# EAGLE design minime_2.1.1 (EAGLE 7.5.0)
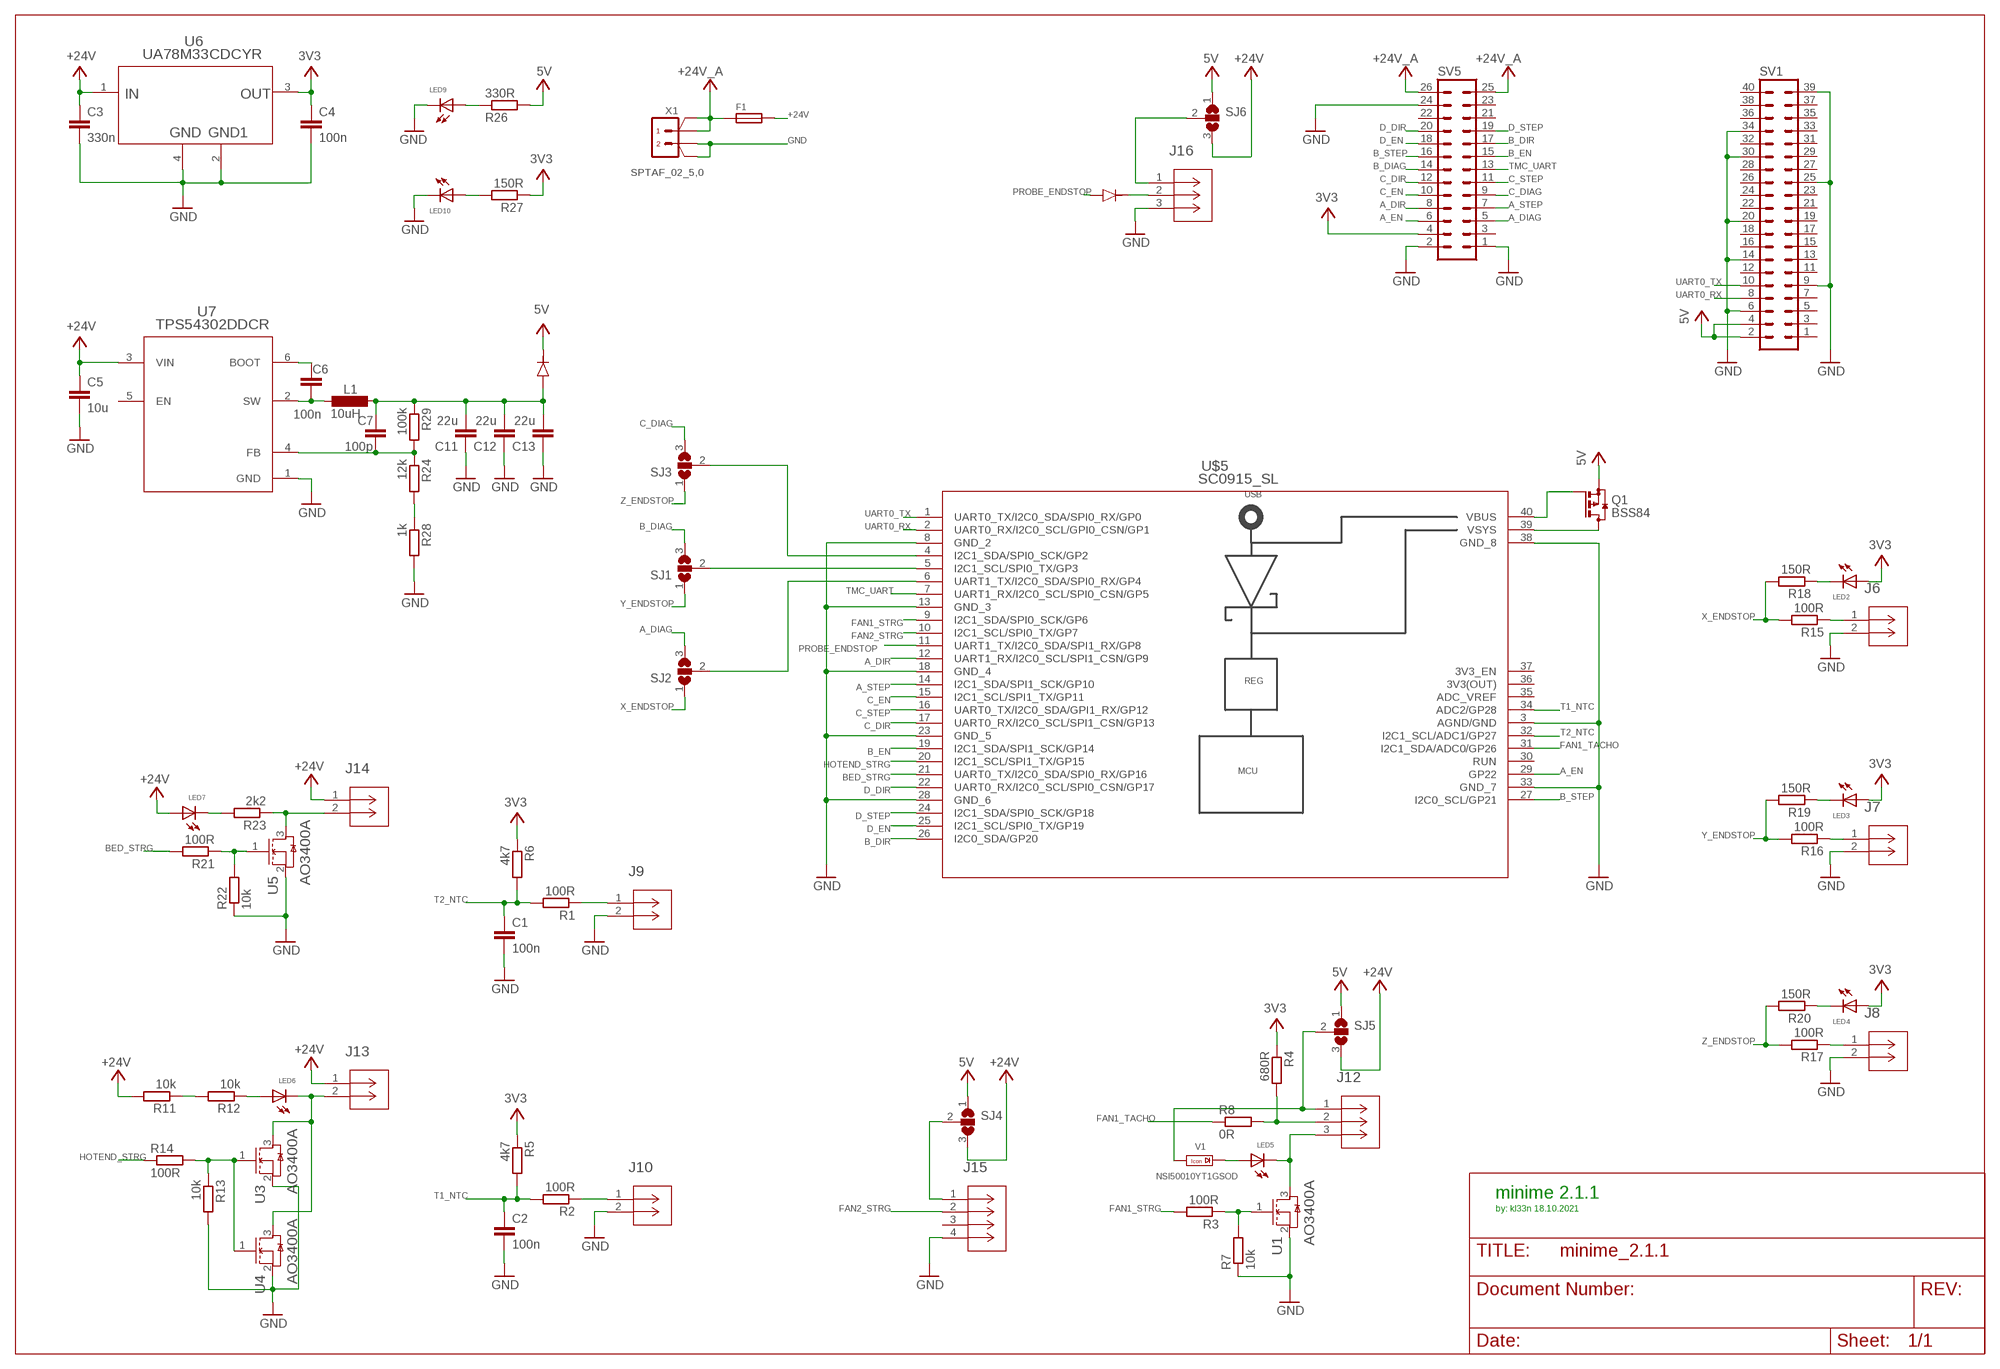
[diagram p0: schematic, sheet 1]

## Parts
C1  100n  C-EUC0603  [C0603]
C2  100n  C-EUC0603  [C0603]
C3  330n  C-EUC0603  [C0603]
C4  100n  C-EUC0603  [C0603]
C5  10u  C-EUC0603  [C0603]
C6  100n  C-EUC0603  [C0603]
C7  100p  C-EUC0603  [C0603]
C11  22u  C-EUC1210K  [C1210K]
C12  22u  C-EUC1210K  [C1210K]
C13  22u  C-EUC1210K  [C1210K]
CR1  SS54  SS14-E3/5AT  [DIODE_DO214AC]
CR2  SS14  SS14-E3/5AT  [DIODE_DO214AC]
F1  FUSE/SERIE154  [FUSE/NANO-OMNI]
J6  B2B-XH-A(LF)(SN)  [CONN_B2B-XH-A(LF)(SN)_JST]
J7  B2B-XH-A(LF)(SN)  [CONN_B2B-XH-A(LF)(SN)_JST]
J8  B2B-XH-A(LF)(SN)  [CONN_B2B-XH-A(LF)(SN)_JST]
J9  B2B-XH-A(LF)(SN)  [CONN_B2B-XH-A(LF)(SN)_JST]
J10  B2B-XH-A(LF)(SN)  [CONN_B2B-XH-A(LF)(SN)_JST]
J12  B3B-XH-A(LF)(SN)  [CONN_B3B-XH-A_JST]
J13  B2B-XH-A(LF)(SN)  [CONN_B2B-XH-A(LF)(SN)_JST]
J14  B2B-XH-A(LF)(SN)  [CONN_B2B-XH-A(LF)(SN)_JST]
J15  B4B-XH-AM(LF)(SN)  [CONN_B4B-XH-AM_JST]
J16  B3B-XH-A(LF)(SN)  [CONN_B3B-XH-A_JST]
L1  10uH  L-EUWE-TPC  [POWER-CHOKE_WE-TPC]
LED2  LEDCHIP-LED0603  [CHIP-LED0603]
LED3  LEDCHIP-LED0603  [CHIP-LED0603]
LED4  LEDCHIP-LED0603  [CHIP-LED0603]
LED5  LEDCHIP-LED0603  [CHIP-LED0603]
LED6  LEDCHIP-LED0603  [CHIP-LED0603]
LED7  LEDCHIP-LED0603  [CHIP-LED0603]
LED9  LEDCHIP-LED0603  [CHIP-LED0603]
LED10  LEDCHIP-LED0603  [CHIP-LED0603]
Q1  BSS84  [SOT23]
R1  100R  R-EU_R0603  [R0603]
R2  100R  R-EU_R0603  [R0603]
R3  100R  R-EU_R0603  [R0603]
R4  680R  R-EU_R0603  [R0603]
R5  4k7  R-EU_R0603  [R0603]
R6  4k7  R-EU_R0603  [R0603]
R7  10k  R-EU_R0603  [R0603]
R8  0R  R-EU_R0603  [R0603]
R11  10k  R-EU_R0603  [R0603]
R12  10k  R-EU_R0603  [R0603]
R13  10k  R-EU_R0603  [R0603]
R14  100R  R-EU_R0603  [R0603]
R15  100R  R-EU_R0603  [R0603]
R16  100R  R-EU_R0603  [R0603]
R17  100R  R-EU_R0603  [R0603]
R18  150R  R-EU_R0603  [R0603]
R19  150R  R-EU_R0603  [R0603]
R20  150R  R-EU_R0603  [R0603]
R21  100R  R-EU_R0603  [R0603]
R22  10k  R-EU_R0603  [R0603]
R23  2k2  R-EU_R0603  [R0603]
R24  12k  R-EU_R0603  [R0603]
R26  330R  R-EU_R0603  [R0603]
R27  150R  R-EU_R0603  [R0603]
R28  1k  R-EU_R0603  [R0603]
R29  100k  R-EU_R0603  [R0603]
SJ1  SJ2W  [SJ_2]
SJ2  SJ2W  [SJ_2]
SJ3  SJ2W  [SJ_2]
SJ4  SJ2W  [SJ_2]
SJ5  SJ2W  [SJ_2]
SJ6  SJ2W  [SJ_2]
SV1  MA20-2  [MA20-2]
SV5  MA13-2  [MA13-2]
U1  AO3400A  [SOT-23-3L_AOS]
U3  AO3400A  [SOT-23-3L_AOS]
U4  AO3400A  [SOT-23-3L_AOS]
U5  AO3400A  [SOT-23-3L_AOS]
U6  UA78M33CDCYR  [DCY0004A_N]
U7  TPS54302DDCR  [DDC0006A_N]
U$5  SC0915_SL  [STIFTLEISTE]
V1  NSI50010YT1GSOD  [SOD123]
X1  SPTAF_02_5,0  [5-2]

## Nets
3V3: C4.1 LED2.A LED3.A LED4.A R4.1 R5.1 R6.1 R27.1 SV5.4 U6.3(OUTPUT)
5V: CR1.1 Q1.2(S) R26.2 SJ4.1 SJ5.1 SJ6.1 SV1.2 SV1.4
+24V: C3.1 C5.1 F1.2 J13.1 J14.1 LED7.A R11.2 SJ4.3 SJ5.3 SJ6.3 U6.1(INPUT) U7.3(VIN)
+24V_A: F1.1 SV5.25 SV5.26 X1.1 X1.1A
A_DIAG: SJ2.3 SV5.5
A_DIAG_X_ENDSTOP: SJ2.2 U$5.6(UART1_TX/I2C0_SDA/SPI0_RX/GP4)
A_DIR: SV5.8 U$5.12(UART1_RX/I2C0_SCL/SPI1_CSN/GP9)
A_EN: SV5.6 U$5.29(GP22)
A_STEP: SV5.7 U$5.14(I2C1_SDA/SPI1_SCK/GP10)
B_DIAG: SJ1.3 SV5.14
B_DIAG_Y_ENDSTOP: SJ1.2 U$5.5(I2C1_SCL/SPI0_TX/GP3)
B_DIR: SV5.17 U$5.26(I2C0_SDA/GP20)
B_EN: SV5.15 U$5.19(I2C1_SDA/SPI1_SCK/GP14)
B_STEP: SV5.16 U$5.27(I2C0_SCL/GP21)
BED_STRG: R21.2 U$5.21(UART0_TX/I2C0_SDA/SPI0_RX/GP16)
C_DIAG: SJ3.3 SV5.9
C_DIAG_Z_ENDSTOP: SJ3.2 U$5.4(I2C1_SDA/SPI0_SCK/GP2)
C_DIR: SV5.12 U$5.17(UART0_RX/I2C0_SCL/SPI1_CSN/GP13)
C_EN: SV5.10 U$5.15(I2C1_SCL/SPI1_TX/GP11)
C_STEP: SV5.11 U$5.16(UART0_TX/I2C0_SDA/GPI1_RX/GP12)
D_DIR: SV5.20 U$5.22(UART0_RX/I2C0_SCL/SPI0_CSN/GP17)
D_EN: SV5.18 U$5.25(I2C1_SCL/SPI0_TX/GP19)
D_STEP: SV5.19 U$5.24(I2C1_SDA/SPI0_SCK/GP18)
FAN1_STRG: R3.2 U$5.9(I2C1_SDA/SPI0_SCK/GP6)
FAN1_TACHO: R8.1 U$5.31(I2C1_SDA/ADC0/GP26)
FAN2_STRG: J15.2 U$5.10(I2C1_SCL/SPI0_TX/GP7)
GND: C1.2 C2.2 C3.2 C4.2 C5.2 C11.1 C12.1 C13.1 J6.2 J7.2 J8.2 J9.2 J10.2 J15.4 J16.3 LED9.C LED10.C R7.1 R13.2 R22.1 R28.2 SV1.6 SV1.9 SV1.14 SV1.20 SV1.25 SV1.30 SV1.34 SV1.39 SV5.1 SV5.2 SV5.24 U1.2(S) U3.2(S) U4.2(S) U5.2(S) U6.2(COMMON_2) U6.4(COMMON) U7.1(GND) U$5.3(AGND/GND) U$5.8(GND_2) U$5.13(GND_3) U$5.18(GND_4) U$5.23(GND_5) U$5.28(GND_6) U$5.33(GND_7) U$5.38(GND_8) X1.2 X1.2A
HOTEND_STRG: R14.1 U$5.20(I2C1_SCL/SPI1_TX/GP15)
N$1: LED6.A R12.1
N$2: R11.1 R12.2
N$3: R21.1 R22.2 U5.1(G)
N$4: R13.1 R14.2 U3.1(G) U4.1(G)
N$5: J16.1 SJ6.2
N$6: LED5.A V1.C(K)
N$11: J14.2 R23.1 U5.3(D)
N$22: J8.1 R17.1
N$23: J7.1 R16.1
N$24: J6.1 R15.1
N$25: J10.1 R2.1
N$26: LED2.C R18.1
N$27: LED3.C R19.1
N$28: J9.1 R1.1
N$29: J12.2 R4.2 R8.2
N$30: LED4.C R20.1
N$31: R3.1 R7.2 U1.1(G)
N$33: LED7.C R23.2
N$35: J12.3 LED5.C U1.3(D)
N$37: J13.2 LED6.C U3.3(D) U4.3(D)
N$40: LED9.A R26.1
N$41: J12.1 SJ5.2 V1.A
N$42: LED10.A R27.2
N$43: J15.1 SJ4.2
N$44: CR2.1 J16.2
N$45: R24.2 R28.1
N$47: C6.1 U7.6(BOOT)
N$48: C6.2 L1.2 U7.2(SW)
N$49: C7.2 R24.1 R29.2 U7.4(FB)
N$50: C7.1 C11.2 C12.2 C13.2 CR1.2 L1.1 R29.1
PROBE_ENDSTOP: CR2.2 U$5.11(UART1_TX/I2C0_SDA/SPI1_RX/GP8)
T1_NTC: C2.1 R2.2 R5.2 U$5.34(ADC2/GP28)
T2_NTC: C1.1 R1.2 R6.2 U$5.32(I2C1_SCL/ADC1/GP27)
TMC_UART: SV5.13 U$5.7(UART1_RX/I2C0_SCL/SPI0_CSN/GP5)
UART0_RX: SV1.8 U$5.2(UART0_RX/I2C0_SCL/GPI0_CSN/GP1)
UART0_TX: SV1.10 U$5.1(UART0_TX/I2C0_SDA/SPI0_RX/GP0)
VBUS: Q1.1(G) U$5.40(VBUS)
VSYS: Q1.3(D) U$5.39(VSYS)
X_ENDSTOP: R15.2 R18.2 SJ2.1
Y_ENDSTOP: R16.2 R19.2 SJ1.1
Z_ENDSTOP: R17.2 R20.2 SJ3.1
Unconnected: J15.3 SV1.1 SV1.3 SV1.5 SV1.7 SV1.11 SV1.12 SV1.13 SV1.15 SV1.16 SV1.17 SV1.18 SV1.19 SV1.21 SV1.22 SV1.23 SV1.24 SV1.26 SV1.27 SV1.28 SV1.29 SV1.31 SV1.32 SV1.33 SV1.35 SV1.36 SV1.37 SV1.38 SV1.40 SV5.3 SV5.21 SV5.22 SV5.23 U7.5(EN) U$5.30(RUN) U$5.36(3V3(OUT))

## Notes on the sheet
- USB
- REG
- MCU
- minime 2.1.1
- by: kl33n 18.10.2021

## Power pins joined to a net without a drawn wire
3V3_EN: U$5.37(3V3_EN)
ADC_VREF: U$5.35(ADC_VREF)

## Library data of the parts
C1-C7 C11-C13 = rcl:C-EU: CAPACITOR, European symbol
CR1 CR2 = SS14:SS14-E3/5AT; COPYRIGHT: Copyright (C) 2021 Ultra Librarian. All rights reserved.; MANUFACTURER_PART_NUMBER: SS14-E3/5AT; MFR_NAME: Vishay
F1 = RPG_parts:FUSE/SERIE154: FUSE, with Holder, Serie 154, SMD OMNI-BLOK
J6-J10 J13 J14 = B2B-XH-A:B2B-XH-A(LF)(SN); BUILT_BY: EMA_Cory; COPYRIGHT: Copyright (C) 2018 Accelerated Designs. All rights reserved; MANUFACTURER_PART_NUMBER: B2B-XH-A(LF)(SN); SOURCELIBRARY: JST_2019-12-02; VENDOR: JST
J12 J16 = B3B-XH-A:B3B-XH-A(LF)(SN); BUILT_BY: EMA_Cory; COPYRIGHT: Copyright (C) 2018 Accelerated Designs. All rights reserved; DATASHEET: https://www.jst-mfg.com/product/pdf/eng/eXH.pdf; MANUFACTURER_PART_NUMBER: B3B-XH-A(LF)(SN); SOURCELIBRARY: Add_to_database_2021-02-04; VENDOR: JST
J15 = B4B-XH-A:B4B-XH-AM(LF)(SN); BUILT_BY: EMA_Cory; COPYRIGHT: Copyright (C) 2018 Accelerated Designs. All rights reserved; DATASHEET: http://www.jst-mfg.com/product/pdf/eng/eXH.pdf; MANUFACTURER_PART_NUMBER: B4B-XH-AM(LF)(SN); SOURCELIBRARY: Add_to_database_2020-12-30; VENDOR: JST
L1 = rcl:L-EU: INDUCTOR, European symbol
LED2-LED7 LED9 LED10 = led:LED: LED OSRAM: - CHIPLED LG R971, LG N971, LY N971, LG Q971, LY Q971, LO R971, LY R971 LH N974, LH R974 LS Q976, LO Q976, LY Q976 LO Q996 - Hyper CHIPLED LW Q18S LB Q993, LB Q99A, LB R99A - SideLED LS A670, LO A670, LY A670, LG A670, LP A670 LB A673, LV A673, LT A673, LW A673 LH A674 LY A675 LS A676, LA A676, LO A676, LY A676, LW A676 LS A679, LY A679, LG A679 - Hyper Micro SIDELED® LS Y876, LA Y876, LO Y876, LY Y876 LT Y87S - SmartLED LW L88C, LW L88S LB L89C, LB L89S, LG L890 LS L89K, LO L89K, LY L89K LS L896, LA L896, LO L896, LY L896 - TOPLED LS T670, LO T670, LY T670, LG T670, LP T670 LSG T670, LSP T670, LSY T670, LOP T670, LYG T670 LG T671, LOG T671, LSG T671 LB T673, LV T673, LT T673, LW T673 LH T674 LS T676, LA T676, LO T676, LY T676, LB T676, LH T676, LSB T676, LW T676 LB T67C, LV T67C, LT T67C, LS T67K, LO T67K, LY T67K, LW E67C LS E67B, LA E67B, LO E67B, LY E67B, LB E67C, LV E67C, LT E67C LW T67C LS T679, LY T679, LG T679 LS T770, LO T770, LY T770, LG T770, LP T770 LB T773, LV T773, LT T773, LW T773 LH T774 LS E675, LA E675, LY E675, LS T675 LS T776, LA T776, LO T776, LY T776, LB T776 LHGB T686 LT T68C, LB T68C - Hyper Mini TOPLED® LB M676 - Mini TOPLED Santana® LG M470 LS M47K, LO M47K, LY M47K Source: http://www.osram.convergy.de LUXEON: - LUMILED® LXK2-PW12-R00, LXK2-PW12-S00, LXK2-PW14-U00, LXK2-PW14-V00 LXK2-PM12-R00, LXK2-PM12-S00, LXK2-PM14-U00 LXK2-PE12-Q00, LXK2-PE12-R00, LXK2-PE12-S00, LXK2-PE14-T00, LXK2-PE14-U00 LXK2-PB12-K00, LXK2-PB12-L00, LXK2-PB12-M00, LXK2-PB14-N00, LXK2-PB14-P00, LXK2-PB14-Q00 LXK2-PR12-L00, LXK2-PR12-M00, LXK2-PR14-Q00, LXK2-PR14-R00 LXK2-PD12-Q00, LXK2-PD12-R00, LXK2-PD12-S00 LXK2-PH12-R00, LXK2-PH12-S00 LXK2-PL12-P00, LXK2-PL12-Q00, LXK2-PL12-R00 Source: www.luxeon.com KINGBRIGHT: KA-3528ASYC Source: www.kingbright.com
Q1 = transistor-small-signal:BSS84: P-CHANNEL MOS FET
R1-R8 R11-R24 R26-R29 = rcl:R-EU_: RESISTOR, European symbol
SJ1-SJ6 = jumper:SJ2W: SMD solder JUMPER
SV1 = con-lstb:MA20-2: PIN HEADER; OC_FARNELL: unknown; OC_NEWARK: unknown
SV5 = con-lstb:MA13-2: PIN HEADER; OC_FARNELL: unknown; OC_NEWARK: unknown
U1 U3-U5 = AO3400A:AO3400A; BUILT_BY: EMA_Molly; COPYRIGHT: Copyright (C) 2018 Accelerated Designs. All rights reserved; MANUFACTURER_PART_NUMBER: AO3400A; SOURCELIBRARY: Alpha_and_Omega_2019-12-17; VENDOR: Alpha and Omega
U6 = UA78M33:UA78M33CDCYR; COPYRIGHT: Copyright (C) 2021 Ultra Librarian. All rights reserved.; MANUFACTURER_PART_NUMBER: UA78M33CDCYR; MFR_NAME: Texas Instruments; REFDES: RefDes; TYPE: TYPE
U7 = TPS54302:TPS54302DDCR; COPYRIGHT: Copyright (C) 2021 Ultra Librarian. All rights reserved.; MANUFACTURER_PART_NUMBER: TPS54302DDCR; MFR_NAME: Texas Instruments; REFDES: RefDes; TYPE: TYPE
U$5 = pi_pico:SC0915_SL
V1 = RPG_parts:NSI50010YT1G; FARNELL: 1794979
X1 = Phoenix_SPTAF-WTB:SPTAF_02_: SPTAF 1/ 2-3,5-EL - Wire-To-Board-Reihenklemme, 3.5 mm, 2 -polig, 24 AWG, 16 AWG, 1.5 mm², Steckanschluss

## Board
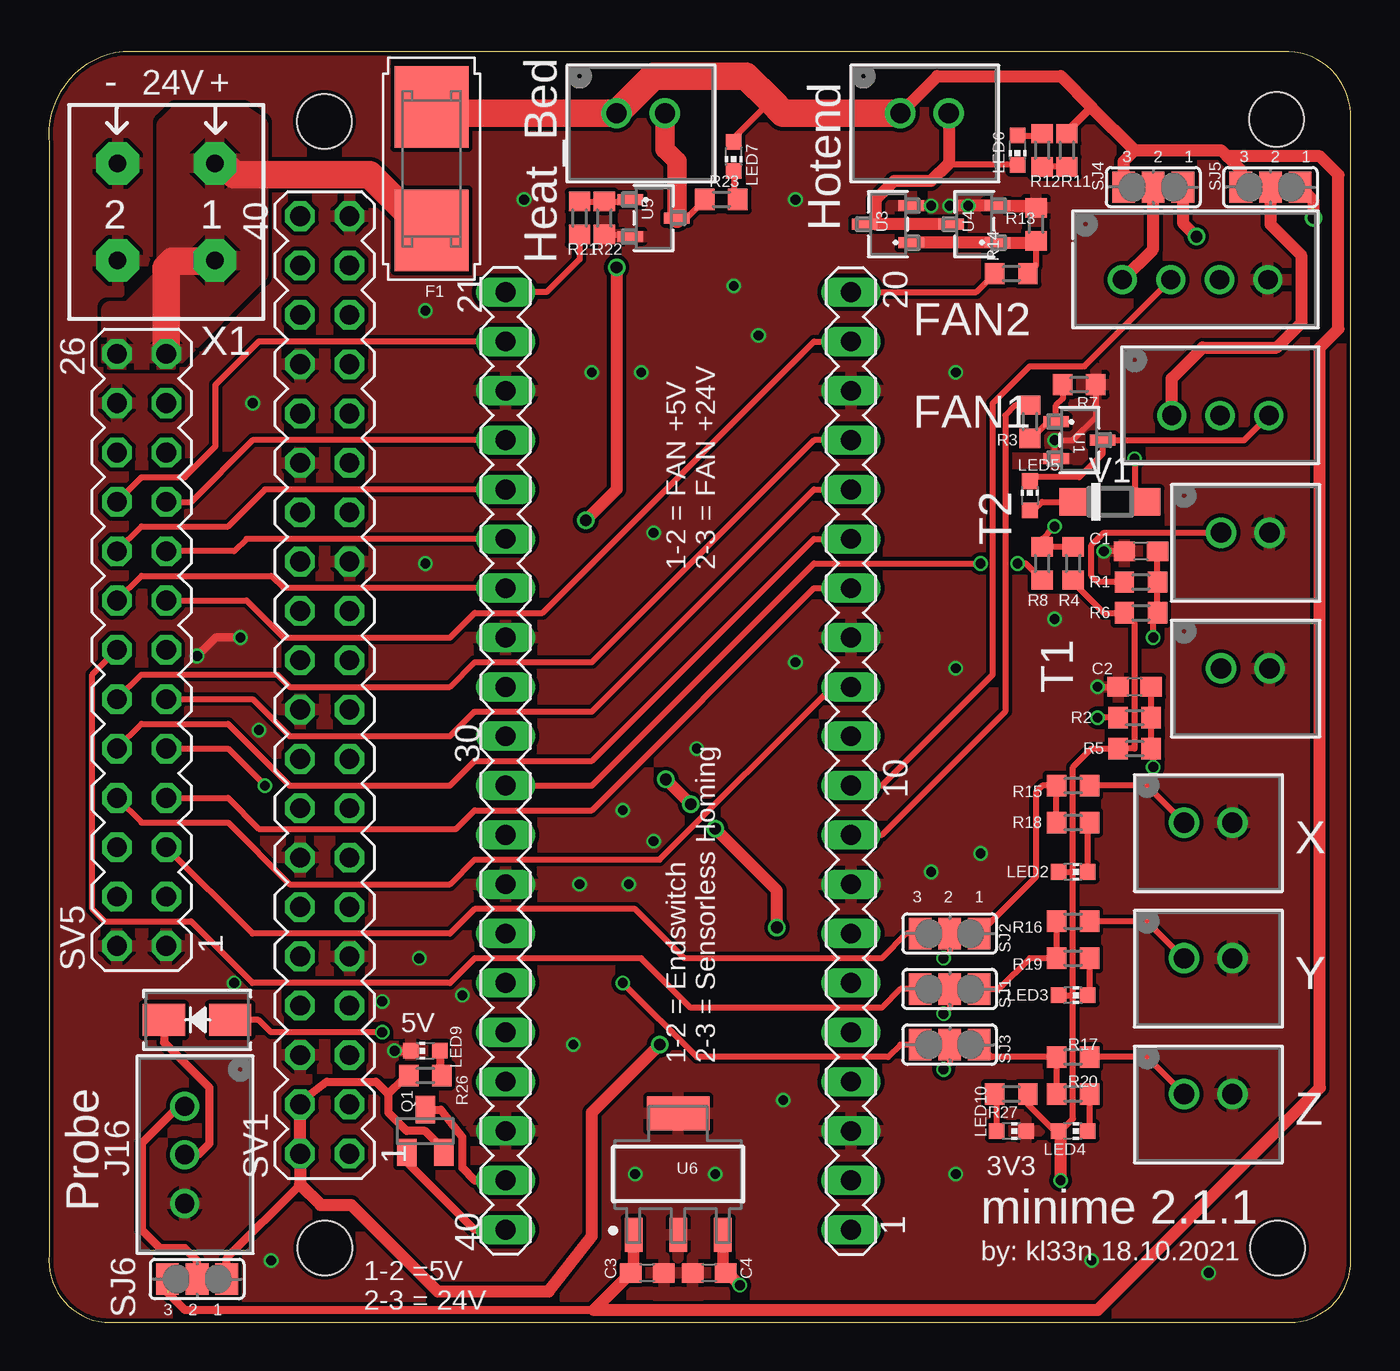
[diagram p1: board, top side]
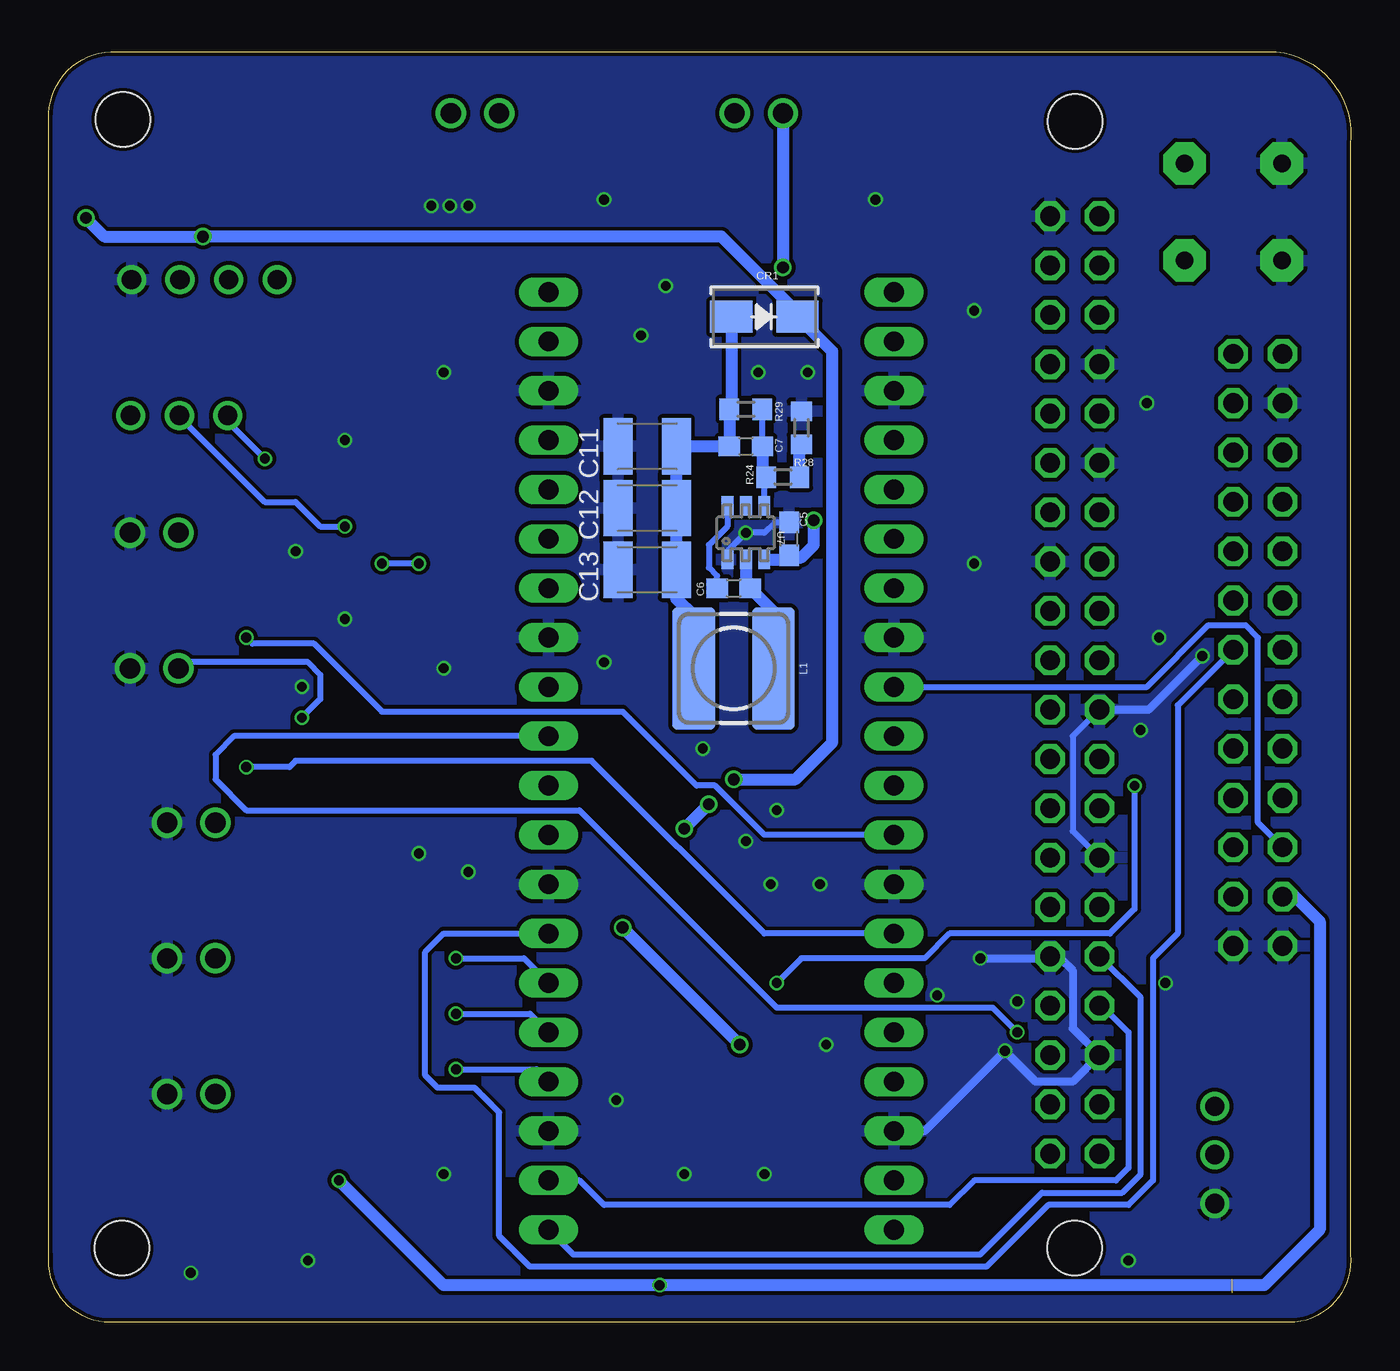
[diagram p2: board, bottom side, seen from below]

Size 67.03 x 65.41 mm. Coordinates in mm from the lower left corner, seen from the top.
Outline: 0.03,60.64 0.03,3.49 arc90 2.88,0 64.16,0 arc90 67.02,3.49 67.02,62.23 arc90 63.53,65.41 3.84,65.41 arc90 0.03,60.64
Copper layers (1*16): Top 0.018mm / dielectric 1.55mm / Bottom 0.018mm
Design rules "Multi-CB_2L_100µm-Tracks_OL35µm": minimum track width 0.1mm, minimum drill 0.2mm, track to track 0.1mm, track to pad 0.1mm, pad to pad 0.1mm, via to via 0.1mm, smd to smd 0mil, copper to edge 0.2mm, drill to drill 0.2mm, minimum pad ring 0.125mm, minimum via ring 0.1mm, stop-mask expansion 2mil, vias tented up to drill 0.45mm, thermal gap 0.2mm
Holes 2.8 mm at 14.22,3.81 14.19,61.8 63.26,3.81 63.21,61.91

### Footprints (pad centres in the part's own frame; a part is rotated, then mirrored left to right if it is on the bottom)
C0603 = smd 1.1 x 1: 1 -0.85,0; 2 0.85,0
C1210K = smd 1.5 x 2.9: 1 -1.5,0; 2 1.5,0
DIODE_DO214AC = smd 2.174 x 1.651: 1 -1.705,0; 2 1.705,0
FUSE/NANO-OMNI = smd 4.2 x 3.8: 1 -3.17,0; 2 3.17,0
CONN_B2B-XH-A(LF)(SN)_JST = drill 1.041 pad 1.549: 1 0,0; 2 -2.489,0
CONN_B3B-XH-A_JST = drill 0.991 pad 1.499: 1 0,0; 2 2.489,0; 3 5.004,0
CONN_B4B-XH-AM_JST = drill 0.991 pad 1.499: 1 0,0; 2 2.489,0; 3 5.004,0; 4 7.493,0
POWER-CHOKE_WE-TPC = smd 6.3 x 2.2: 1 0,2.05; 2 0,-2.05
CHIP-LED0603 = smd 0.8 x 0.8: A 0,-0.75; C 0,0.75
SOT23 = smd 1 x 1.4: 1 -0.95,-1.1; 2 0.95,-1.1; 3 0,1.1
R0603 = smd 1 x 1.1: 1 -0.85,0; 2 0.85,0
SJ_2 = smd 1.168 x 1.6: 1 -1.524,0; 2 0,0; 3 1.524,0
MA20-2 = drill 1.016 octagon: 1 -24.13,-1.27; 2 -24.13,1.27; 3 -21.59,-1.27; 4 -21.59,1.27; 5 -19.05,-1.27; 6 -19.05,1.27; 7 -16.51,-1.27; 8 -16.51,1.27; 9 -13.97,-1.27; 10 -13.97,1.27; 11 -11.43,-1.27; 12 -11.43,1.27; 13 -8.89,-1.27; 14 -8.89,1.27; 15 -6.35,-1.27; 16 -6.35,1.27; 17 -3.81,-1.27; 18 -3.81,1.27; 19 -1.27,-1.27; 20 -1.27,1.27; 21 1.27,-1.27; 22 1.27,1.27; 23 3.81,-1.27; 24 3.81,1.27; 25 6.35,-1.27; 26 6.35,1.27; 27 8.89,-1.27; 28 8.89,1.27; 29 11.43,-1.27; 30 11.43,1.27; 31 13.97,-1.27; 32 13.97,1.27; 33 16.51,-1.27; 34 16.51,1.27; 35 19.05,-1.27; 36 19.05,1.27; 37 21.59,-1.27; 38 21.59,1.27; 39 24.13,-1.27; 40 24.13,1.27
MA13-2 = drill 1.016 octagon: 1 -15.24,-1.27; 2 -15.24,1.27; 3 -12.7,-1.27; 4 -12.7,1.27; 5 -10.16,-1.27; 6 -10.16,1.27; 7 -7.62,-1.27; 8 -7.62,1.27; 9 -5.08,-1.27; 10 -5.08,1.27; 11 -2.54,-1.27; 12 -2.54,1.27; 13 0,-1.27; 14 0,1.27; 15 2.54,-1.27; 16 2.54,1.27; 17 5.08,-1.27; 18 5.08,1.27; 19 7.62,-1.27; 20 7.62,1.27; 21 10.16,-1.27; 22 10.16,1.27; 23 12.7,-1.27; 24 12.7,1.27; 25 15.24,-1.27; 26 15.24,1.27
SOT-23-3L_AOS = smd 0.568 x 1.31: 1 -0.953,-1.194; 2 0.953,-1.194; 3 0,1.194
DCY0004A_N = smd 1.75 x 0.9: 1 -3.125,2.3; 2 -3.125,0; 3 -3.125,-2.3 | smd 1.75 x 3.2: 4 3.125,0
DDC0006A_N = smd 1 x 0.6: 1 -1.375,0.95; 2 -1.375,0; 3 -1.375,-0.95; 4 1.375,-0.95; 5 1.375,0; 6 1.375,0.95
STIFTLEISTE = drill 1.016 long: 1 -8.89,22.86; 2 -8.89,20.32; 3 -8.89,17.78; 4 -8.89,15.24; 5 -8.89,12.7; 6 -8.89,10.16; 7 -8.89,7.62; 8 -8.89,5.08; 9 -8.89,2.54; 10 -8.89,0; 11 -8.89,-2.54; 12 -8.89,-5.08; 13 -8.89,-7.62; 14 -8.89,-10.16; 15 -8.89,-12.7; 16 -8.89,-15.24; 17 -8.89,-17.78; 18 -8.89,-20.32; 19 -8.89,-22.86; 20 -8.89,-25.4; 21 8.89,-25.4; 22 8.89,-22.86; 23 8.89,-20.32; 24 8.89,-17.78; 25 8.89,-15.24; 26 8.89,-12.7; 27 8.89,-10.16; 28 8.89,-7.62; 29 8.89,-5.08; 30 8.89,-2.54; 31 8.89,0; 32 8.89,2.54; 33 8.89,5.08; 34 8.89,7.62; 35 8.89,10.16; 36 8.89,12.7; 37 8.89,15.24; 38 8.89,17.78; 39 8.89,20.32; 40 8.89,22.86
SOD123 = smd 1.4 x 1.4: A 1.9,0; C -1.9,0
5-2 = drill 0.9 pad 2.2 octagon: 1 -2.5,2.5; 1A -2.5,-2.5; 2 2.5,2.5; 2A 2.5,-2.5

### Placement (x,y rotation side)
C1  56.22,39.69 180 top
C2  55.91,32.7 180 top
C3  30.82,2.54 0 top
C4  34,2.54 180 top
C5  28.92,40.32 90 bottom
C6  31.78,37.78 0 bottom
C7  31.14,45.09 0 bottom
C11  36.22,45.09 0 bottom
C12  36.22,41.91 0 bottom
C13  36.22,38.73 0 bottom
CR1  30.19,51.75 180 bottom
CR2  7.65,15.56 0 top
F1  19.71,59.37 90 top
J6  58.45,25.72 180 top
J7  58.45,18.73 180 top
J8  58.45,11.75 180 top
J9  60.35,40.64 180 top
J10  60.35,33.66 180 top
J12  57.81,46.67 0 top
J13  43.84,62.23 180 top
J14  29.24,62.23 180 top
J15  55.27,53.66 0 top
J16  7.01,11.11 270 top
L1  31.78,33.66 90 bottom
LED2  52.73,23.18 270 top
LED3  52.73,16.83 270 top
LED4  52.73,9.84 270 top
LED5  50.51,42.55 0 top
LED6  49.87,60.33 180 top
LED7  35.27,60.01 180 top
LED9  19.39,13.97 90 top
LED10  49.56,9.84 270 top
Q1  19.39,9.84 0 top
R1  56.22,38.1 0 top
R2  55.91,31.11 0 top
R3  50.51,46.35 90 top
R4  52.73,39.05 90 top
R5  55.91,29.53 0 top
R6  56.22,36.51 0 top
R7  53.05,48.26 180 top
R8  51.14,39.05 90 top
R11  52.41,60.33 90 top
R12  51.14,60.33 270 top
R13  50.83,56.52 90 top
R14  49.56,53.98 0 top
R15  52.73,27.62 180 top
R16  52.73,20.64 180 top
R17  52.73,13.65 180 top
R18  52.73,25.72 180 top
R19  52.73,18.73 180 top
R20  52.73,11.75 180 top
R21  27.33,56.83 270 top
R22  28.6,56.83 90 top
R23  34.63,57.78 0 top
R24  29.24,43.5 0 bottom
R26  19.39,12.7 180 top
R27  49.56,11.75 180 top
R28  28.28,46.04 90 bottom
R29  31.14,46.99 0 bottom
SJ1  46.38,17.14 180 top
SJ2  46.38,20 180 top
SJ3  46.38,14.29 180 top
SJ4  56.86,58.42 180 top
SJ5  62.89,58.42 180 top
SJ6  7.65,2.22 180 top
SV1  14.21,32.8 90 top
SV5  4.79,34.61 90 top
U1  53.05,45.4 270 top
U3  43.21,56.52 90 top
U4  47.65,56.52 90 top
U5  31.14,56.83 270 top
U6  32.41,7.62 90 top
U7  31.14,40.64 90 bottom
U$5  32.41,27.62 180 top
V1  54.64,42.23 0 top
X1  6.06,57.15 180 top

### Tracks (layer width: path | path; a pad name or v marks a point on that pad's centre or on a via)
3V3  (via drill 0.5)
  Top 0.305: LED4.A 51.98,9.73 | R27.1 50.41,11.21 51.78,9.84 LED4.A | LED4.A 52.1,9.84 52.73,10.48 52.73,16.83 | 52.73,16.83 52.73,23.18 | 52.73,23.18 52.73,28.57 53.68,29.53 R5.1 55.91,29.53 55.91,35.98 R6.1 54.32,36.51 52.73,38.1 R4.1 | LED2.A 52.73,23.18 | LED3.A 52.73,16.83
  Top 0.406: U6.3 34.71,2.78
  Top 0.6: U6.3 34.71,2.68 C4.1
  Top 0.61: v52.1,7.3 52.1,9.73 LED4.A | 34.71,2.78 v35.59,1.91
  Bottom 0.61: v52.1,7.3 46.7,1.91 v35.59,1.91 4.47,1.91 1.61,4.76 1.61,20.64 2.88,21.91 SV5.4
5V  (via drill 0.6)
  Top 0.406: SV1.4 12.94,11.33 14.31,12.38 16.85,12.38 17.49,11.75 | 17.49,11.75 17.49,10.79 18.44,9.84 19.39,9.84 20.34,8.89 Q1.2 | R26.2 18.23,12.48 17.49,11.75 | SJ6.1 9.17,3.31 12.94,7.08
  Top 0.61: SV1.4 SV1.2 12.94,7.08 14,6.03 15.58,6.03 20.03,1.59 25.74,1.59 27.97,4.45 27.97,10.79 v31.46,14.29 | v37.49,20.32 37.49,22.23 v34.32,25.4 | v33.05,26.67 v31.78,27.94 | SJ4.1 58.38,56.58 v59.08,55.88 | v65.11,56.83 65.11,57.72 SJ5.1
  Bottom 0.61: v31.46,14.29 v37.49,20.32 | v34.32,25.4 v33.05,26.67 | v31.78,27.94 28.6,27.94 26.7,29.84 26.7,49.97 CR1.1 | v65.11,56.83 64.16,55.88 v59.08,55.88 32.41,55.88 28.48,51.95 CR1.1 | 28.6,51.63 CR1.1
+24V  (via drill 0.6)  (1 unrouted)
  Top 0.305: LED7.A 35.27,60.96 37.17,62.87
  Top 0.406: 28.07,0.64 7.01,0.64 6.12,1.52 | J14.1 | F1.2 18.13,62.23 | R11.2 52.41,61.28 53.68,62.55
  Top 0.6: U6.1 30.11,2.68 C3.1
  Top 0.61: 29.87,2.44 C3.1 28.07,0.64 54,0.64 65.43,12.06 65.43,50.16 66.38,51.12 66.38,59.05 65.43,60.01 60.67,60.01 | v29.24,54.29 29.24,42.86 v27.65,41.27 | SJ4.3 55.33,59.75 55.91,60.33 | 55.91,60.33 60.35,60.33 60.67,60.01 | 60.67,60.01 61.37,59.31 SJ5.3 | J13.1 45.75,64.14 52.1,64.14 53.68,62.55 55.91,60.33
  Top 1.422: J14.1 31.14,64.14 35.9,64.14 37.17,62.87 37.81,62.23 J13.1 | J14.1 20.03,62.23 F1.2
  Bottom 0.61: U7.3 29.13,39.27 C5.1 28.82,39.37 28.28,39.37 27.65,40.01 v27.65,41.27 | J14.1 v29.24,54.29
+24V_A
  Top 1.422: F1.1 19.71,55.88 16.54,59.05 9.55,59.05 8.96,59.65 X1.1A | SV5.25 6.06,54.29 6.38,54.61 8.52,54.61
  pour Top: 6.38,49.53 3.2,49.53 3.2,52.07 4.15,52.07 6.06,53.98 6.06,61.59 6.69,62.23 9.87,62.23 10.82,61.59 10.82,53.98
A_DIAG
  Top 0.305: SJ2.3 44.16,20 42.89,18.73 32.73,18.73 30.19,21.27 21.93,21.27 20.66,20 10.5,20 SV5.5
A_DIAG_X_ENDSTOP  (via drill 0.5)
  Top 0.305: SJ2.2 46.38,19.05 v46.06,18.73
  Bottom 0.305: v46.06,18.73 42.57,18.73 U$5.6
A_DIR
  Top 0.305: SV5.8 4.79,25.72 9.23,25.72 12.41,22.54 20.66,22.54 21.93,23.81 31.46,23.81 40.35,32.7 U$5.12
A_EN
  Bottom 0.305: SV5.6 4.79,25.72 4.79,35.24 5.42,35.88 7.33,35.88 10.5,32.7 U$5.29
A_STEP
  Top 0.305: SV5.7 9.23,26.99 10.82,25.4 20.98,25.4 21.93,26.35 27.97,26.35 39.4,37.78 U$5.14
B_DIAG
  Top 0.305: SJ1.3 43.84,17.14 42.89,16.19 33.05,16.19 30.51,18.73 21.93,18.73 20.66,17.46 10.5,17.46 7.33,20.64 2.88,20.64 2.25,21.27 2.25,33.34 SV5.14
B_DIAG_Y_ENDSTOP  (via drill 0.5)
  Top 0.305: SJ1.2 46.38,16.19 v46.06,15.88
  Bottom 0.305: v46.06,15.88 42.25,15.88 U$5.5
B_DIR
  Top 0.305: U$5.26 10.19,40.32 9.55,39.69 SV5.17
B_EN
  Top 0.305: SV5.15 10.19,37.15 12.09,35.24 20.66,35.24 21.93,36.51 25.43,36.51 39.4,50.48 U$5.19
B_STEP
  Top 0.305: U$5.27 12.09,37.78 11.46,38.42 4.79,38.42 SV5.16
BED_STRG
  Top 0.305: R21.2 27.33,54.71 25.64,53.02 U$5.21
C_DIAG  (via drill 0.5)
  Top 0.305: SJ3.3 43.84,14.29 43.21,13.65 33.36,13.65 v29.55,17.46 | SV5.9 9.23,29.53 v11.14,27.62
  Bottom 0.305: v11.14,27.62 11.14,21.27 12.41,20 20.66,20 21.93,18.73 28.28,18.73 v29.55,17.46
C_DIAG_Z_ENDSTOP  (via drill 0.5)
  Top 0.305: SJ3.2 46.38,13.34 v46.06,13.02
  Bottom 0.305: v46.06,13.02 41.94,13.02 U$5.4
C_DIR
  Top 0.305: SV5.12 4.79,33.34 11.77,33.34 12.41,32.7 20.66,32.7 21.93,33.97 27.97,33.97 39.4,45.4 U$5.17
C_EN
  Top 0.305: SV5.10 4.79,30.8 9.23,30.8 12.41,27.62 20.66,27.62 21.93,28.89 27.97,28.89 39.4,40.32 U$5.15
C_STEP
  Top 0.305: SV5.11 10.5,32.07 12.41,30.16 20.66,30.16 21.93,31.43 27.97,31.43 39.4,42.86 U$5.16
D_DIR
  Top 0.305: SV5.20 4.79,43.5 7.01,43.5 8.6,45.09 8.6,48.26 10.82,50.48 U$5.22
D_EN
  Top 0.305: SV5.18 4.79,40.96 9.23,40.96 11.14,42.86 U$5.25
D_STEP
  Top 0.305: U$5.24 10.5,45.4 7.33,42.23 SV5.19
FAN1_STRG
  Top 0.305: R3.2 49.77,47.2 49.24,46.67 49.24,31.43 42.89,25.08 U$5.9
FAN1_TACHO  (via drill 0.5)
  Top 0.305: U$5.31 27.97,27.62 39.4,39.05 v47.97,39.05 | v49.87,39.05 50.29,39.05 R8.1
  Bottom 0.305: v47.97,39.05 v49.87,39.05
FAN2_STRG
  Top 0.305: J15.2 53.31,49.21 50.51,49.21 48.6,47.31 48.6,33.34 42.89,27.62 U$5.10
GND  (via drill 0.5)
  Top 0.305: 51.78,44.53 v51.78,45.4 52.73,45.4 53.9,46.57 R7.1 | v54,32.7 C2.2 | C1.2 v54.32,39.69 | R22.1 29.84,55.98 U5.2
  Top 0.406: v9.87,35.24 8.6,35.24 v7.65,34.29 | v17.81,13.97 LED9.C
  Top 0.61: v46.38,57.47 U4.2 50.72,57.47 R13.2
  Bottom 0.305: SV1.20 14.31,30.16 14.31,25.28 SV1.14 | U7.1 32.09,39.69 v31.14,40.64 30.19,40.64 29.66,41.17 C5.2
  Bottom 0.406: SV1.20 10.4,31.53 v7.65,34.29 | U$5.38 21.93,9.84 v17.81,13.97 16.22,12.38 14.31,12.38 SV1.6 14.31,15.12 14.31,18.1 14.95,18.73 15.58,18.73 | v19.08,18.73 15.58,18.73 | 15.58,18.73 SV1.9
  other vias: 45.43,57.47 46.7,33.66 46.7,48.9 47.33,57.47 29.87,22.54 27.01,14.29 37.81,11.43 53.68,3.17 59.72,2.54 9.55,17.46 24.47,57.78 10.82,30.48 10.5,47.31 27.97,48.9 30.19,7.62 34.32,7.62 21.3,16.83 17.17,16.51 33.36,29.53 29.55,26.35 31.14,24.77 27.33,22.54 38.44,33.97 47.97,24.13 51.78,36.2 46.7,7.62 19.39,39.05 19.39,52.07 35.27,53.34 38.44,57.78 45.43,23.18 11.46,3.17 30.51,48.9 36.54,50.8
  pour Top (isolate 0.2, rank 2): 0.03,65.41 67.02,65.41 67.02,0 0.03,0
  pour Bottom (isolate 0.2, rank 2): 67.02,65.41 0.03,65.41 0.03,0 67.02,0
  pour Top: 31.14,5.71 31.14,1.27 33.68,1.27 33.68,5.71
HOTEND_STRG
  Top 0.305: U$5.20 47.75,53.02 R14.1
N$1
  Top 0.305: LED6.A 50.93,61.08 R12.1
N$2
  Top 0.305: R11.1 R12.2
N$3
  Top 0.305: R21.1 R22.2 29.84,57.68 U5.1
N$4
  Top 0.305: R13.1 50.83,54.4 R14.2
  Top 0.61: U3.1 U4.1 50.72,55.56 R13.1
N$5
  Top 0.406: SJ6.2 7.65,3.17 7.01,3.81 5.74,3.81 4.79,4.76 4.79,9.21 6.69,11.11 J16.1
N$6
  Top 0.305: LED5.A 50.71,41.8 51.14,42.23 V1.C
N$11
  Top 0.305: U5.3 32.83,56.83 R23.1
  Top 1.016: J14.2 31.72,60.38 32.33,59.77 U5.3
N$22
  Top 0.305: J8.1 56.54,13.65 R17.1
N$23
  Top 0.305: J7.1 56.54,20.64 R16.1
N$24
  Top 0.305: J6.1 56.54,27.62 R15.1
N$25  (via drill 0.5)
  Top 0.305: R2.1 v54,31.11
  Bottom 0.305: J10.1 60.03,33.97 53.68,33.97 53.05,33.34 53.05,32.07 v54,31.11
N$26
  Top 0.305: LED2.C 53.48,25.62 R18.1
N$27
  Top 0.305: R19.1 53.58,16.93 LED3.C
N$28
  Top 0.305: R1.1 54,38.1 53.68,38.42 53.68,40.01 54.32,40.64 J9.1
N$29  (via drill 0.5)
  Top 0.305: R4.2 R8.2 51.14,40.32 v51.78,40.96 51.46,40.64
  Bottom 0.305: J12.2 60.3,46.62 55.91,42.23 54.32,42.23 53.05,40.96 v51.78,40.96
N$30
  Top 0.305: R20.1 53.58,9.94 LED4.C
N$31
  Top 0.305: R7.2 52.2,47.54 51.85,47.2 U1.1 51.46,46.35 50.83,45.72 50.72,45.72 R3.1
N$33
  Top 0.305: LED7.C 35.27,58 R23.2
N$35
  Top 0.305: J12.3 61.54,45.4 U1.3 54.24,44.69 53.05,43.5 50.71,43.5 LED5.C
N$37
  Top 0.305: LED6.C 46.39,59.58 46.33,59.64
  Top 0.61: U4.3 42.57,56.52 | 42.57,56.52 U3.3 | J13.2 46.33,59.64 45.43,58.74 43.52,58.74 42.57,57.78 42.57,56.52
N$40
  Top 0.406: LED9.A 20.14,12.8 R26.1
N$41  (via drill 0.5)
  Top 0.305: v55.91,44.45 55.91,42.86 V1.A
  Top 0.61: SJ5.2 62.89,56.52 64.48,54.93 64.48,51.44 63.21,50.16 59.4,50.16 57.81,48.58 J12.1
  Bottom 0.305: J12.1 57.81,46.35 v55.91,44.45
N$42
  Top 0.305: LED10.A 48.81,11.65 R27.2
N$43
  Top 0.61: J15.1 56.86,55.24 SJ4.2
N$44
  Top 0.406: CR2.1 5.94,14.4 8.28,12.06 8.28,9.21 7.7,8.62 J16.2
N$45
  Bottom 0.61: R24.2 28.39,45.09 R28.1
N$47
  Bottom 0.305: U7.6 32.09,40.96 33.05,40.01 33.05,38.84 32.63,38.42 C6.1
N$48
  Bottom 0.61: U7.2 31.14,38 C6.2 29.73,36.58 L1.2
N$49
  Bottom 0.305: U7.4 30.19,43.39 R24.1 | C7.2 R29.2
  Bottom 0.61: C7.2 30.29,43.7 R24.1
N$50
  Bottom 0.61: L1.1 33.83,36.34 34.72,37.23 C13.2 C12.2 C11.2 C7.1 R29.1 31.89,47.09 CR1.2
PROBE_ENDSTOP  (via drill 0.5)
  Top 0.305: v17.17,14.92 11.46,14.92 10.82,15.56 CR2.2
  Bottom 0.305: U$5.11 57.49,30.16 58.45,29.21 58.45,27.94 56.86,26.35 39.71,26.35 29.55,16.19 18.44,16.19 v17.17,14.92
T1_NTC  (via drill 0.5)
  Top 0.305: C2.1 R2.2 R5.2 56.86,29.74 v56.86,28.57
  Bottom 0.305: v56.86,28.57 54.64,28.57 54.32,28.89 39.08,28.89 30.19,20 U$5.34
T2_NTC  (via drill 0.5)
  Top 0.305: C1.1 R1.2 R6.2 56.86,36.73 v56.86,35.24
  Bottom 0.305: v56.86,35.24 56.54,34.92 53.37,34.92 49.87,31.43 37.49,31.43 33.68,27.62 32.73,27.62 30.19,25.08 U$5.32
TMC_UART
  Bottom 0.305: SV5.13 8.92,31.75 8.92,20 10.19,18.73 10.19,7.3 11.46,6.03 15.58,6.03 18.76,2.86 42.25,2.86 43.84,4.45 43.84,10.79 45.11,12.06 47.02,12.06 47.65,12.7 47.65,19.05 46.7,20 U$5.7
UART0_RX
  Bottom 0.305: SV1.8 12.83,16.29 11.46,14.92 11.46,7.94 12.09,7.3 19.39,7.3 20.66,6.03 38.44,6.03 39.71,7.3 U$5.2
UART0_TX
  Bottom 0.305: U$5.1 40.03,3.49 19.08,3.49 15.9,6.67 11.77,6.67 10.82,7.62 10.82,16.71 SV1.10
VBUS
  Top 0.406: Q1.1 18.44,8.42 18.44,8.26 21.93,4.76 U$5.40
VSYS
  Top 0.406: 19.56,11.11 Q1.3 20.2,10.94 21.3,9.53 21.3,7.94 21.93,7.3 U$5.39
X_ENDSTOP
  Top 0.305: R18.2 R15.2 51.14,27.62 50.83,27.3 50.83,22.92 SJ2.1
Y_ENDSTOP
  Top 0.305: R16.2 R19.2 50.51,18.73 48.92,17.14 SJ1.1
Z_ENDSTOP
  Top 0.305: R20.2 R17.2 48.54,13.65 SJ3.1

### Text on the board
tNames: Heat_Bed | Hotend | - | 24V | + | 3 | 2 | 1 | 3 | 2 | 1 | FAN2 | FAN1 | T2 | 1-2 = FAN +5V / 2-3 = FAN +24V | T1 | X | 3 | 2 | 1 | Y | 5V | 1-2 = Endswitch / 2-3 = Sensorless Homing | Z | 3V3 | Probe | minime 2.1.1 | by: kl33n 18.10.2021 | 3 | 2 | 1 | 1-2 =5V / 2-3 = 24V